# Altium schematic sheet VCU_Sch.SchDoc
size A; SheetNumber: 1; SheetTotal: 1
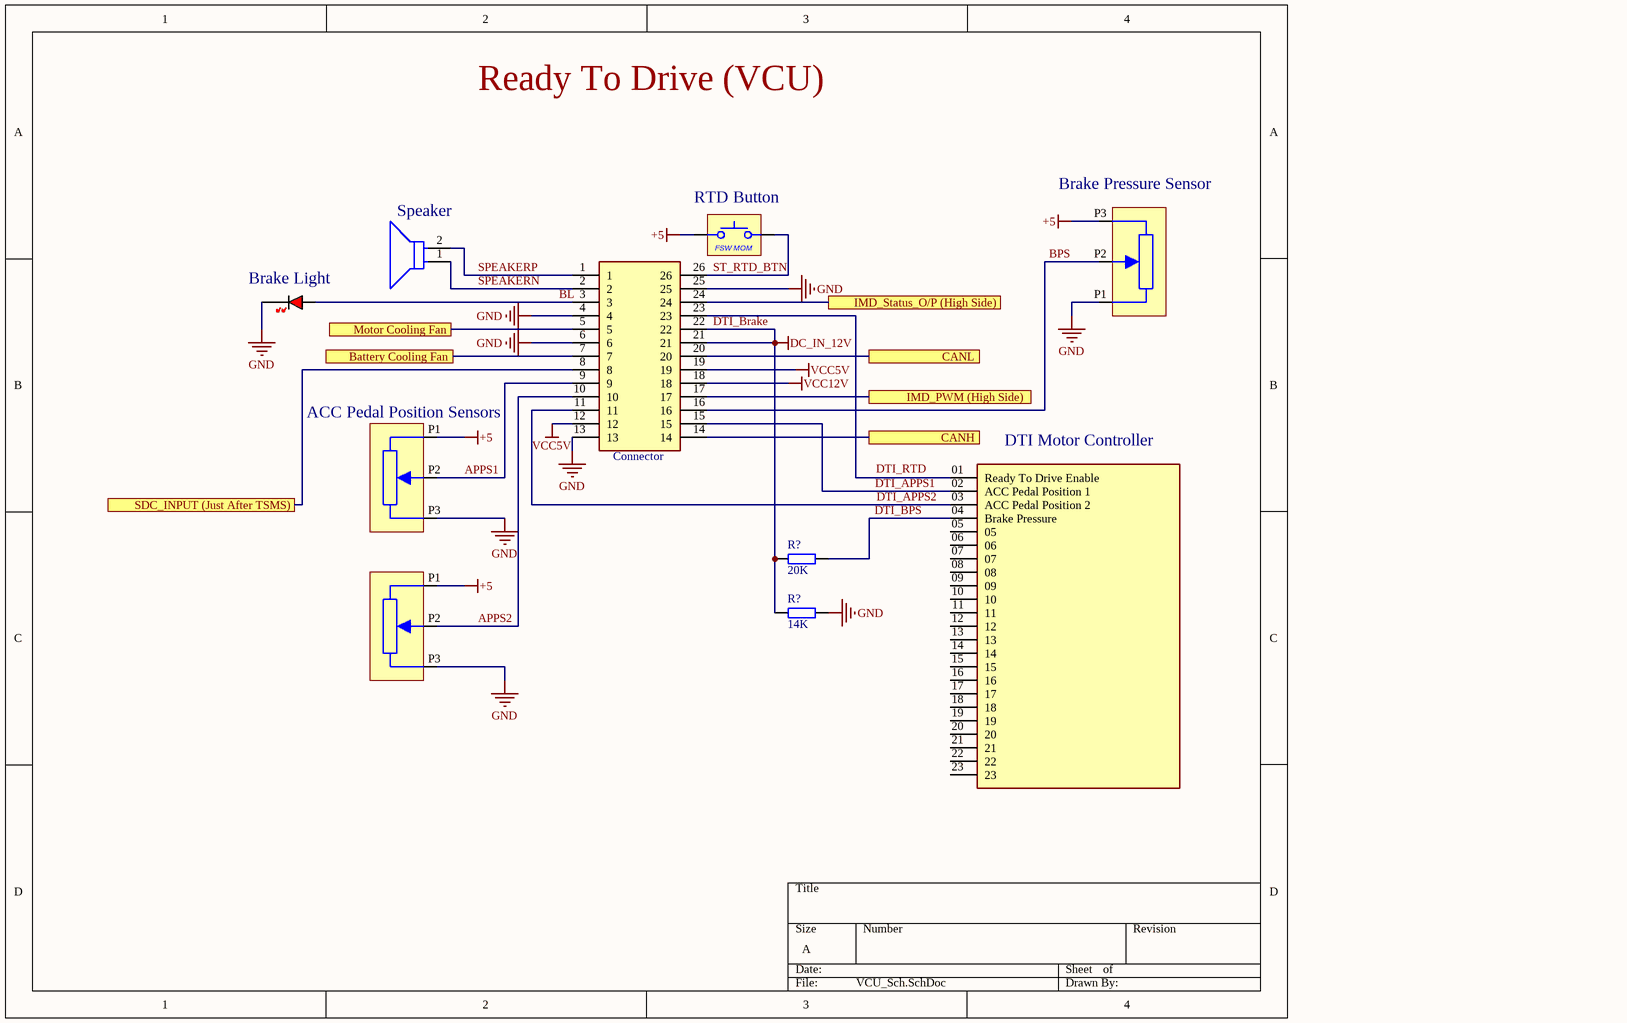
[diagram p0: VCU_Sch.SchDoc]

## Parts
(Parts that share a designator on the sheet are numbered #1, #2 ... from top to bottom, then left to right.)
Brake_Light  RED  [LED_0603_RED]  (value not drawn)
J?#1  Connector  [TE_6437288-6]
J?#2  DTI Motor Controller  [SAMTEC_TSW-123-18-G-S]
PSW?#1  ACC Pedal Position Sensors  [POT_PUSH]  (value not drawn)  (part A of 3)
PSW?#2  ACC Pedal Position Sensors  [POT_PUSH]  (value not drawn)  (part A of 3)
PSW?#3  ACC Pedal Position Sensors  [POT_PUSH]  (value not drawn)  (part A of 3)
R?#1  20K  [RES_0805]
R?#2  14K  [RES_0805]
Speaker  CVS-1508  [FP-CVS-1508-MFG]  (value not drawn)
SW?  RTD Button  [FOOTSWITCH_MOM]

## Ports
Battery Cooling Fan, CANH, CANL, IMD_PWM (High Side) , IMD_Status_O/P (High Side), Motor Cooling Fan, SDC_INPUT (Just After TSMS)

## Nets
+5: PSW?#1.P3 PSW?#2.P1 PSW?#3.P1 SW?.1
DTI_Brake: J?#1.21 J?#1.22 R?#1.1 R?#2.1  [also labelled DC_IN_12V]
GND: Brake_Light.K J?#1.4 J?#1.6 J?#1.13 J?#1.25 PSW?#1.P1 PSW?#2.P3 PSW?#3.P3 R?#2.2
VCC5V: J?#1.12 J?#1.19
VCC12V: J?#1.18
APPS1: J?#1.9 PSW?#2.P2
APPS2: J?#1.10 PSW?#3.P2
Battery Cooling Fan: J?#1.7 ; port Battery Cooling Fan
BL: Brake_Light.A J?#1.3
BPS: J?#1.16 PSW?#1.P2
CANH: J?#1.14 ; port CANH
CANL: J?#1.20 ; port CANL
DTI_APPS1: J?#1.15 J?#2.02(ACC_Pedal_Position_1)
DTI_APPS2: J?#1.11 J?#2.03(ACC_Pedal_Position_2)
DTI_BPS: J?#2.04(Brake_Pressure) R?#1.2
IMD_PWM (High Side) : J?#1.17 ; port IMD_PWM (High Side) 
IMD_Status_O/P (High Side): J?#1.24 ; port IMD_Status_O/P (High Side)
Motor Cooling Fan: J?#1.5 ; port Motor Cooling Fan
SDC_INPUT (Just After TSMS): J?#1.8 ; port SDC_INPUT (Just After TSMS)
SPEAKERN: J?#1.2 Speaker.1(C)
SPEAKERP: J?#1.1 Speaker.2(A)
ST_RTD_BTN: J?#1.26 SW?.2
NetJ?#1_23: J?#1.23 J?#2.01(Ready_To_Drive_Enable)

Not connected (* = marked no-connect by the designer): J?#2 05 06 07 08 09 10 11 12 13 14 15 16 17 18 19 20 21 22 23

## Notes on the sheet
- Ready To Drive (VCU)
- (near PSW?#1) Brake Pressure Sensor
- (near PSW?#2) ACC Pedal Position Sensors
- Labels drawn without touching a wire or pin: DTI_RTD
- (in symbol FOOTSWITCH_MOM) FSW MOM

## Library data of the parts
Brake_Light = LED_0603_RED: LED 0603 RED SMD
J?#1 = 6437288-6: Conn Wire to Board RCP 26 POS 1.5mm Solder ST Thru-Hole Automotive Tube; MF: TE Connectivity; Price: None; Availability: In Stock; MP: 6437288-6; Package: None; SnapEDA_Link: https://www.snapeda.com/parts/6437288-6/TE+Connectivity+AMP+Connectors/view-part/?ref=snap; Check_prices: https://www.snapeda.com/parts/6437288-6/TE+Connectivity+AMP+Connectors/view-part/?ref=eda; Value: *; EU_RoHS_Compliance: Compliant; Purchase-URL: https://pricing.snapeda.com/search/part/6437288-6/?ref=eda
J?#2 = TSW-123-18-G-S: Package: None; Price: None; Value: *; MP: TSW-123-18-G-S; Availability: Unavailable
PSW?#1-PSW?#3 = POT_PUSH: Potentiometer Push-Pull/Push-Push Through-Hole Generic; Manufacturer: *; Manufacturer Part Number: *
R?#1 R?#2 = RES_0805: Resistor SMD 0805; Manufacturer: *; Manufacturer Part Number: *; Distributor Link: *; LCSC: *
Speaker = CMP-14846-000001-1: SPEAKER 8OHM 300MW TOP PORT 87DB; Manufacturer: CUI Inc; Resistance: 8Ω; Value: 8Ω; Frequency: 1700Hz; Description: CVS Seies 15 mm round 7.5 mm deep Mylar 300 mW 8 Ohm 1.7 kHz PCB mount Speaker; Package: CVS-1508; Device Class L1: Electromechanical; Manufacturer Part Number: CVS-1508; Mouser Description: Speakers & Transducers Speakers; Temperature Range High: +55°C; Octopart: https://octopart.com/cvs-1508-cui-21325683; Device Class L2: Audio Products; Temperature Range Low: -20°C; Category: Speak; Digikey Description: SPEAKER 8OHM 300MW TOP PORT 87DB; Temperature: -20°C to +55°C; Height: 8mm; ComponentLink2Description: Datasheet; ComponentLink2URL: https://www.cui.com/product/resource/cvs-1508.pdf; Device Class L3: Speakers; Lead Free: Yes; RoHS: TRUE; Automotive: No
SW? = FOOTSWITCH_MOM: Header 2.54mm THT for Momentary SPST Footswitch